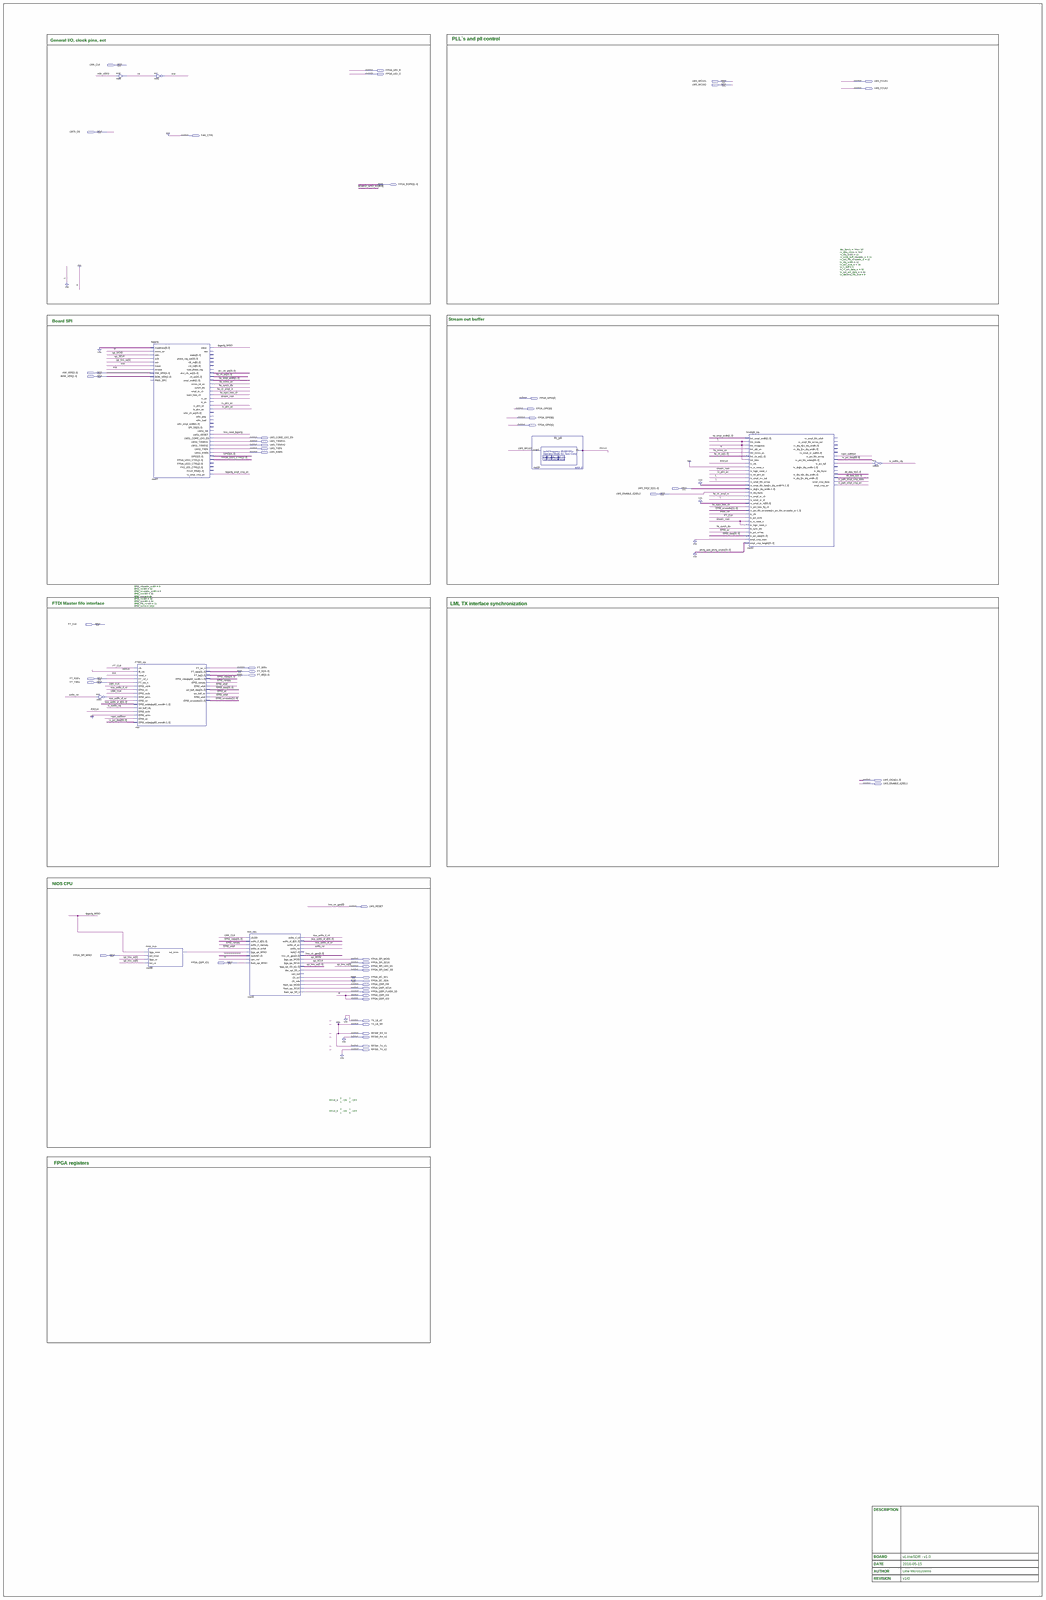
[diagram p0: schematic sheet, whole]
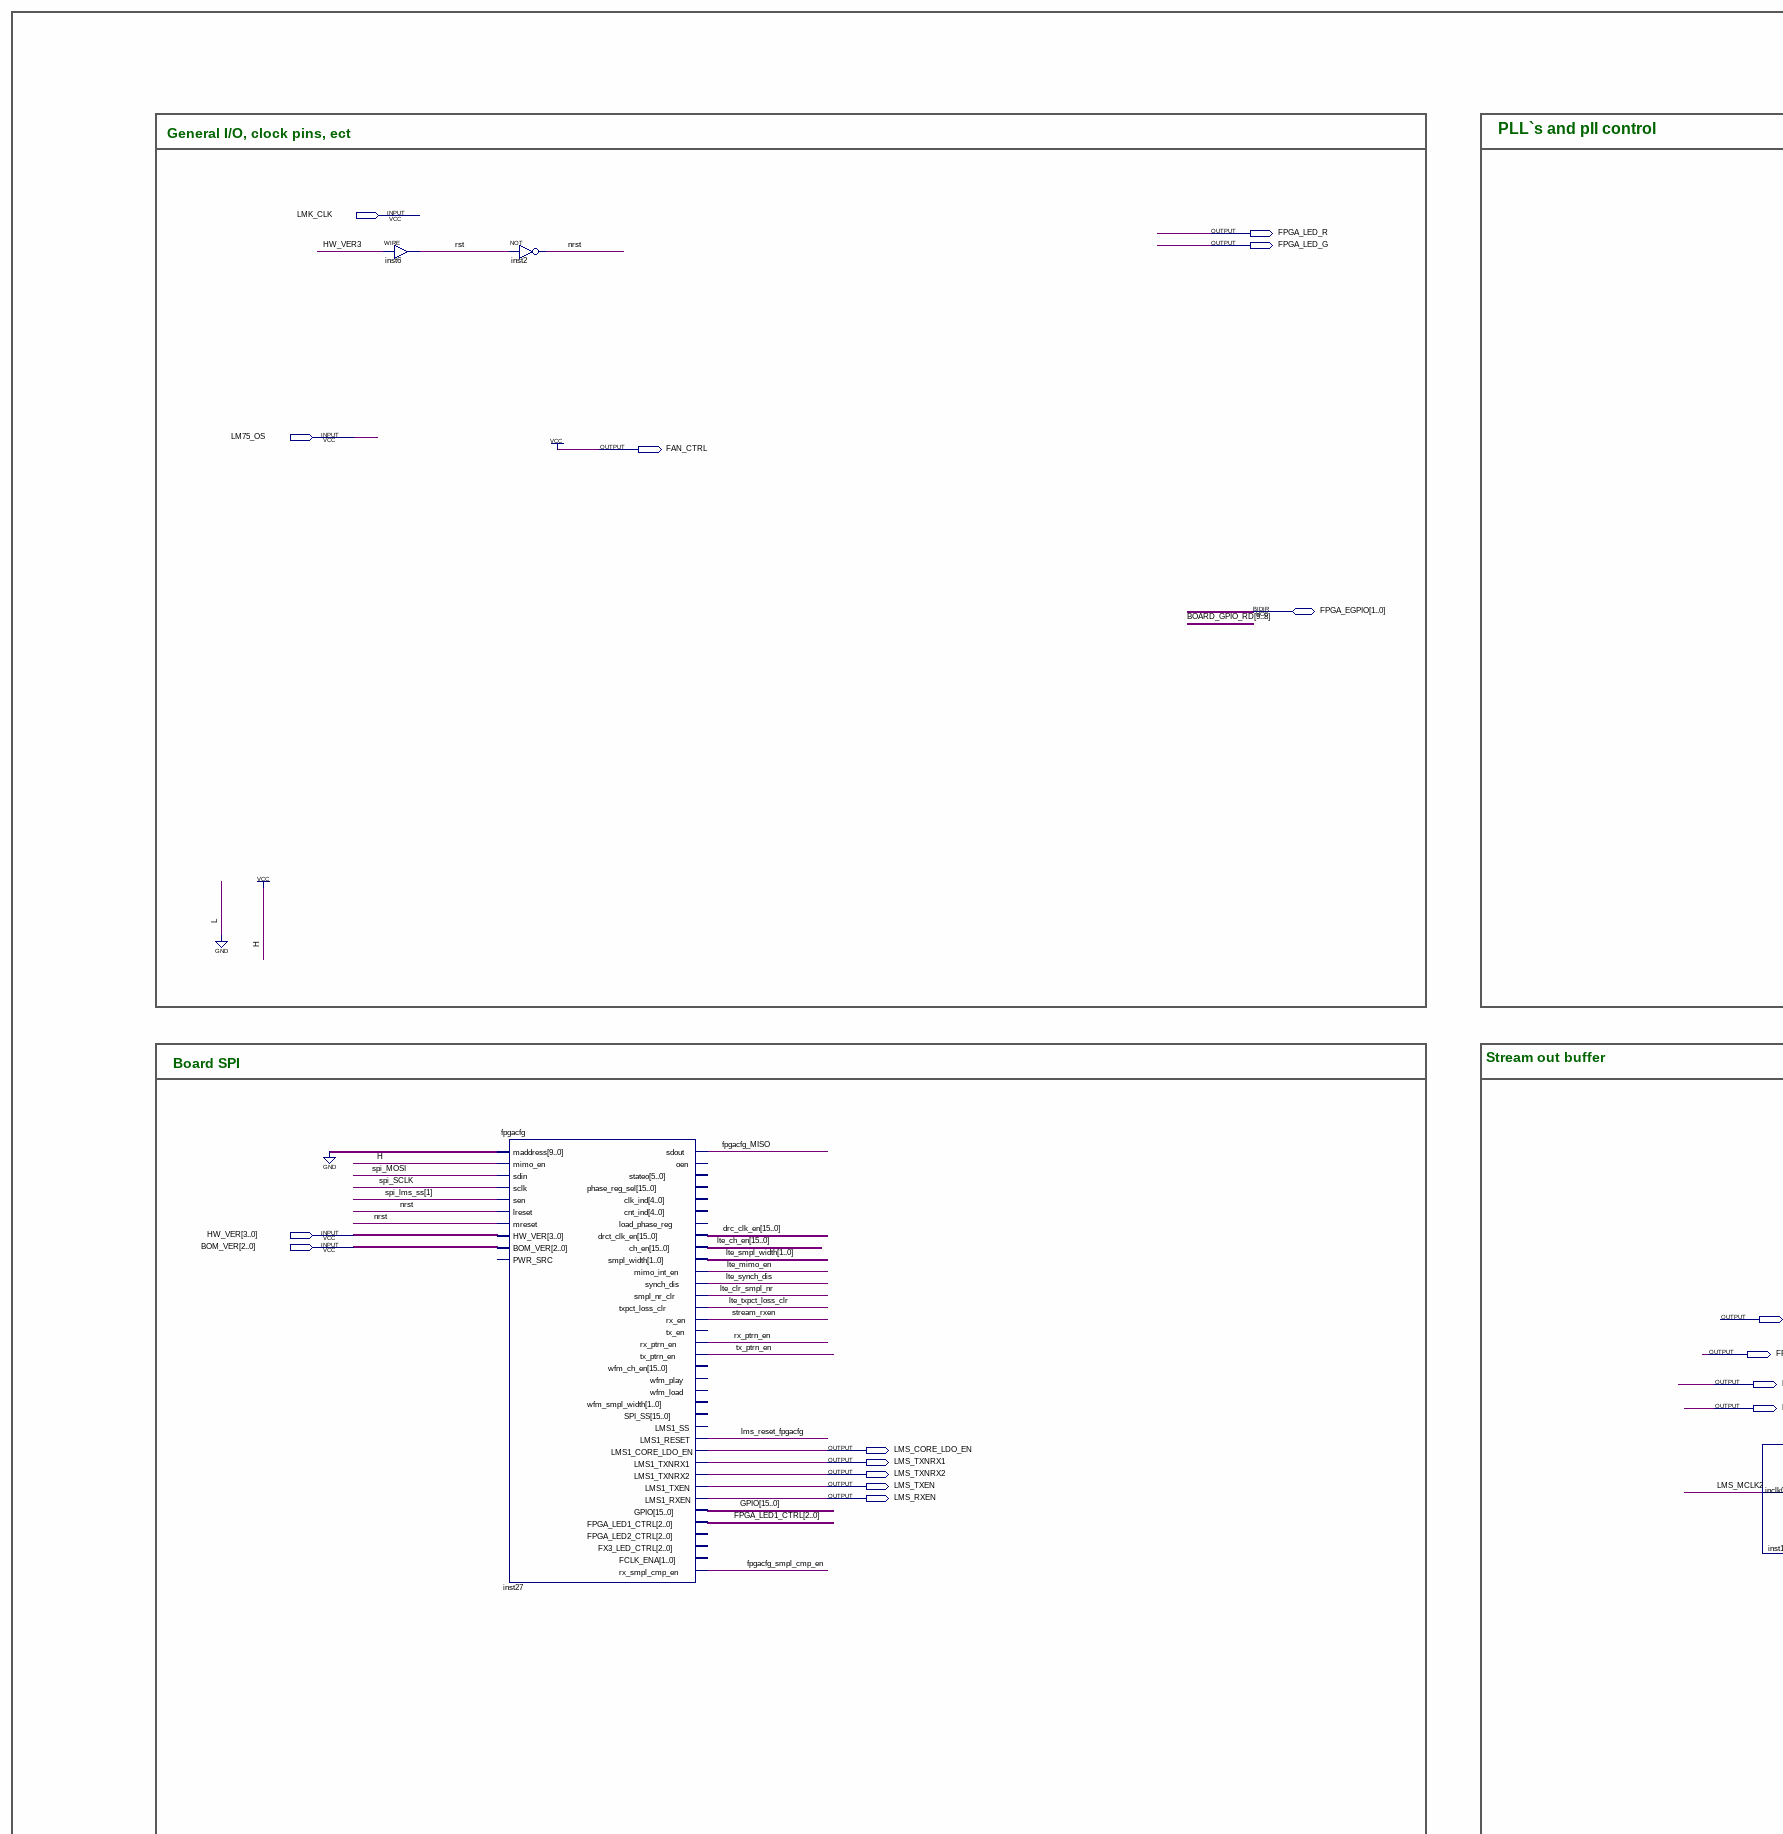
[diagram p1: schematic sheet, upper left part]
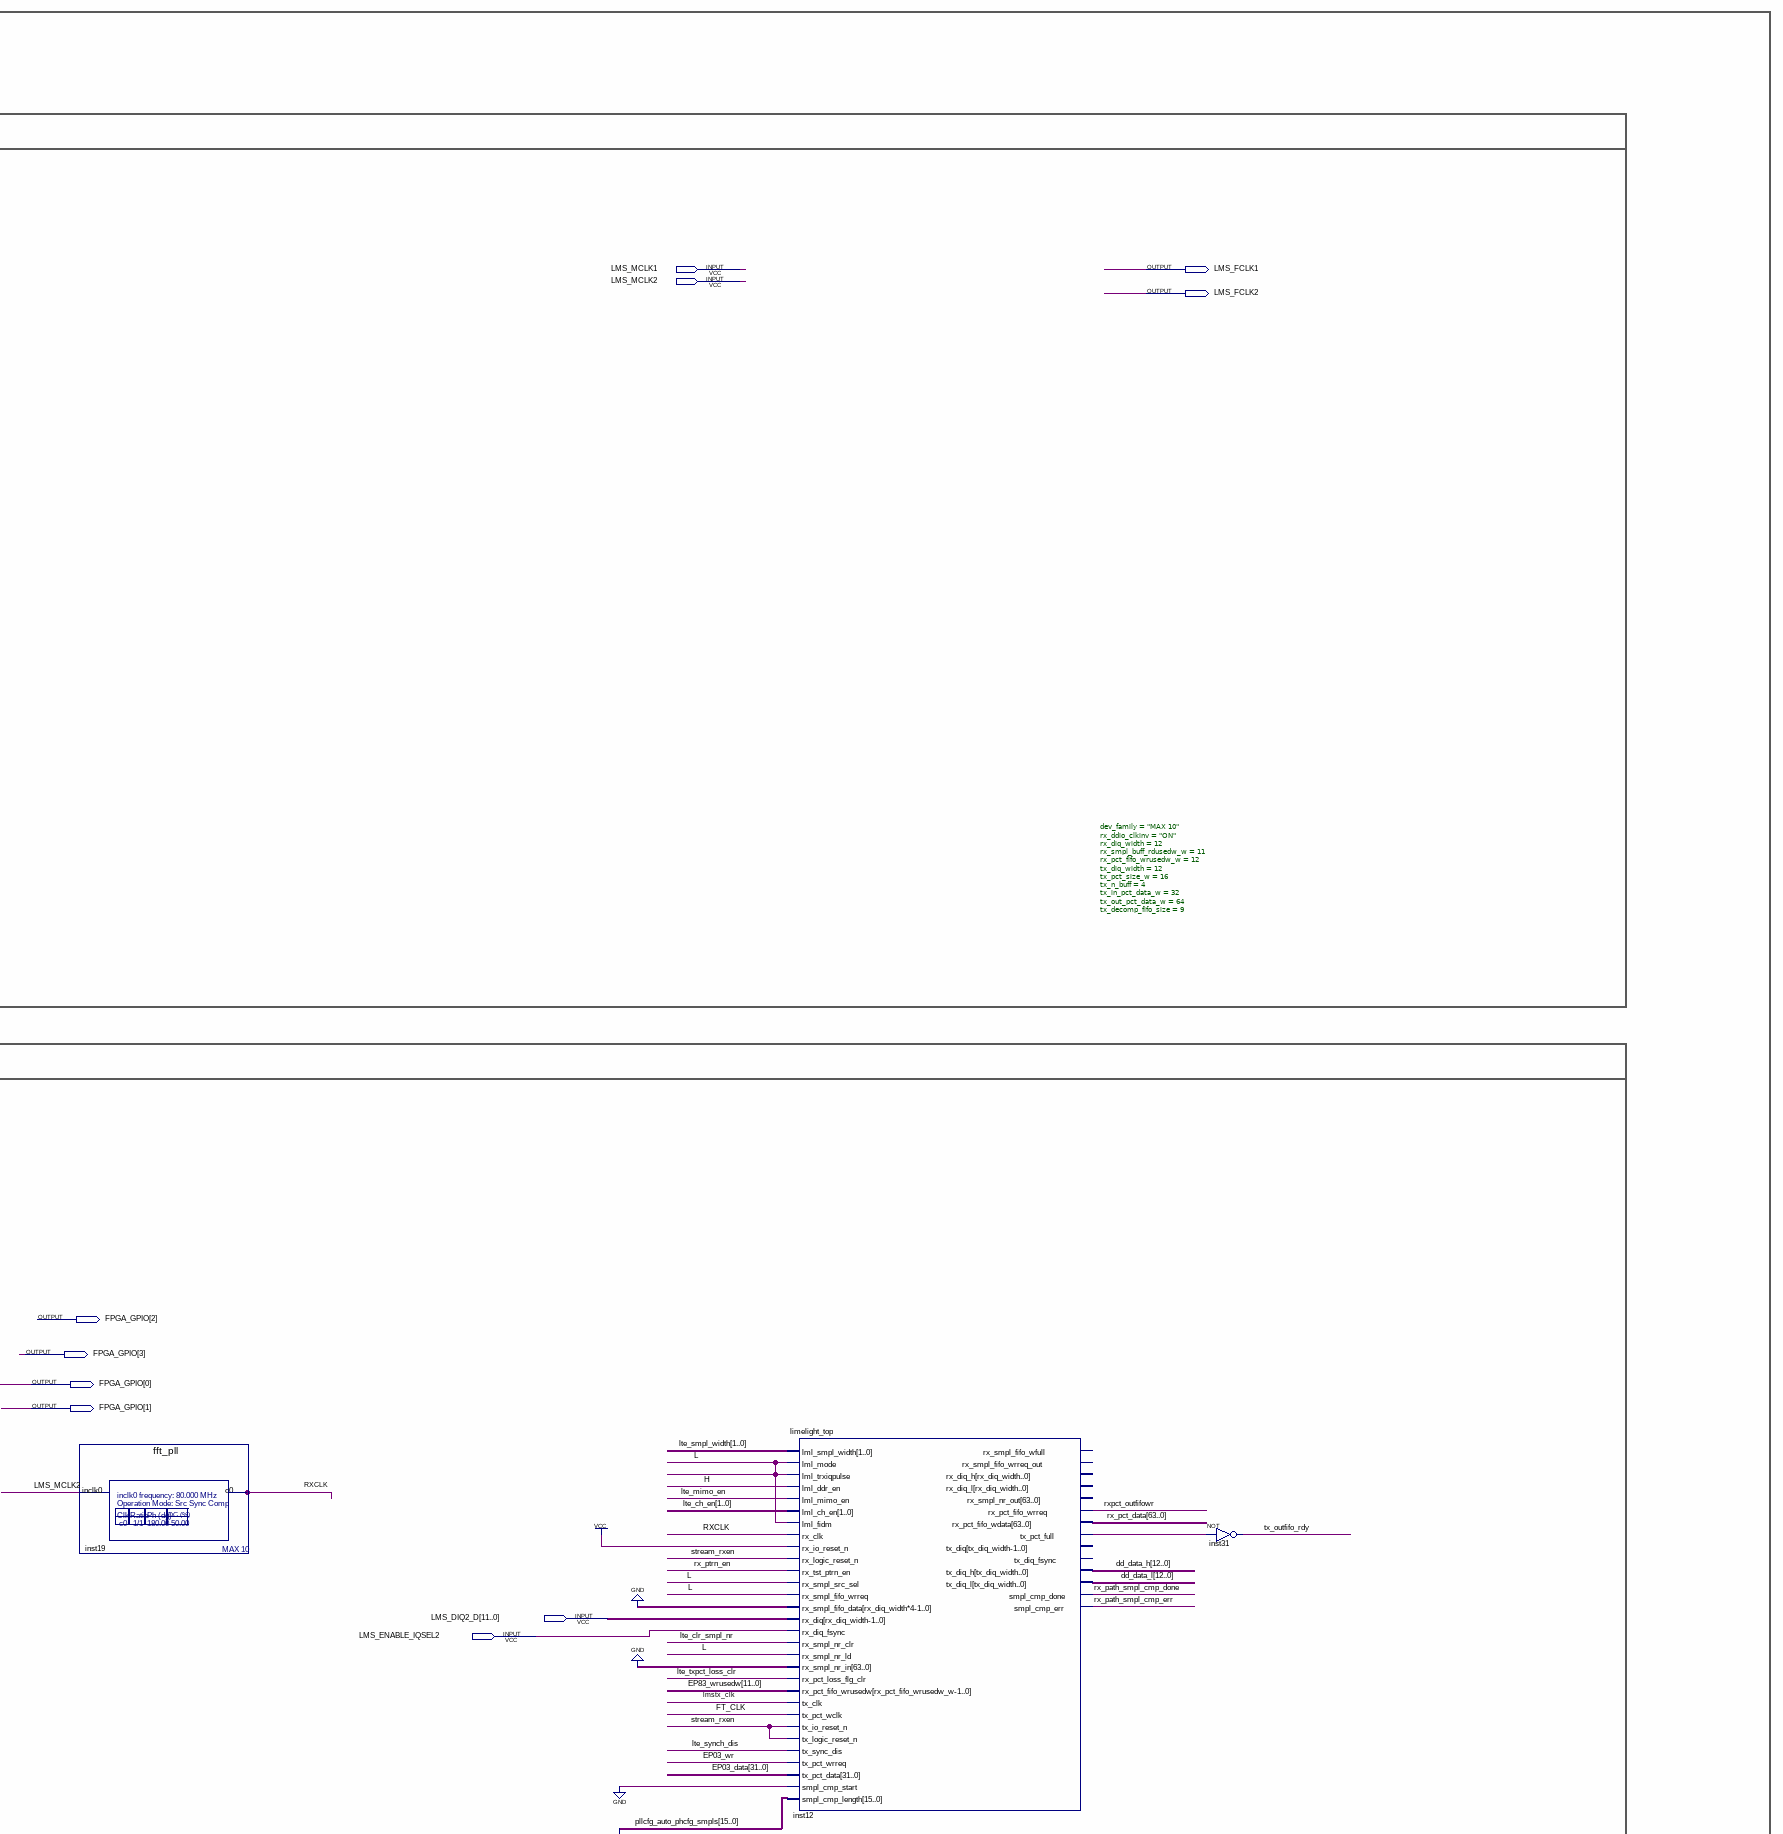
[diagram p2: schematic sheet, upper right part]
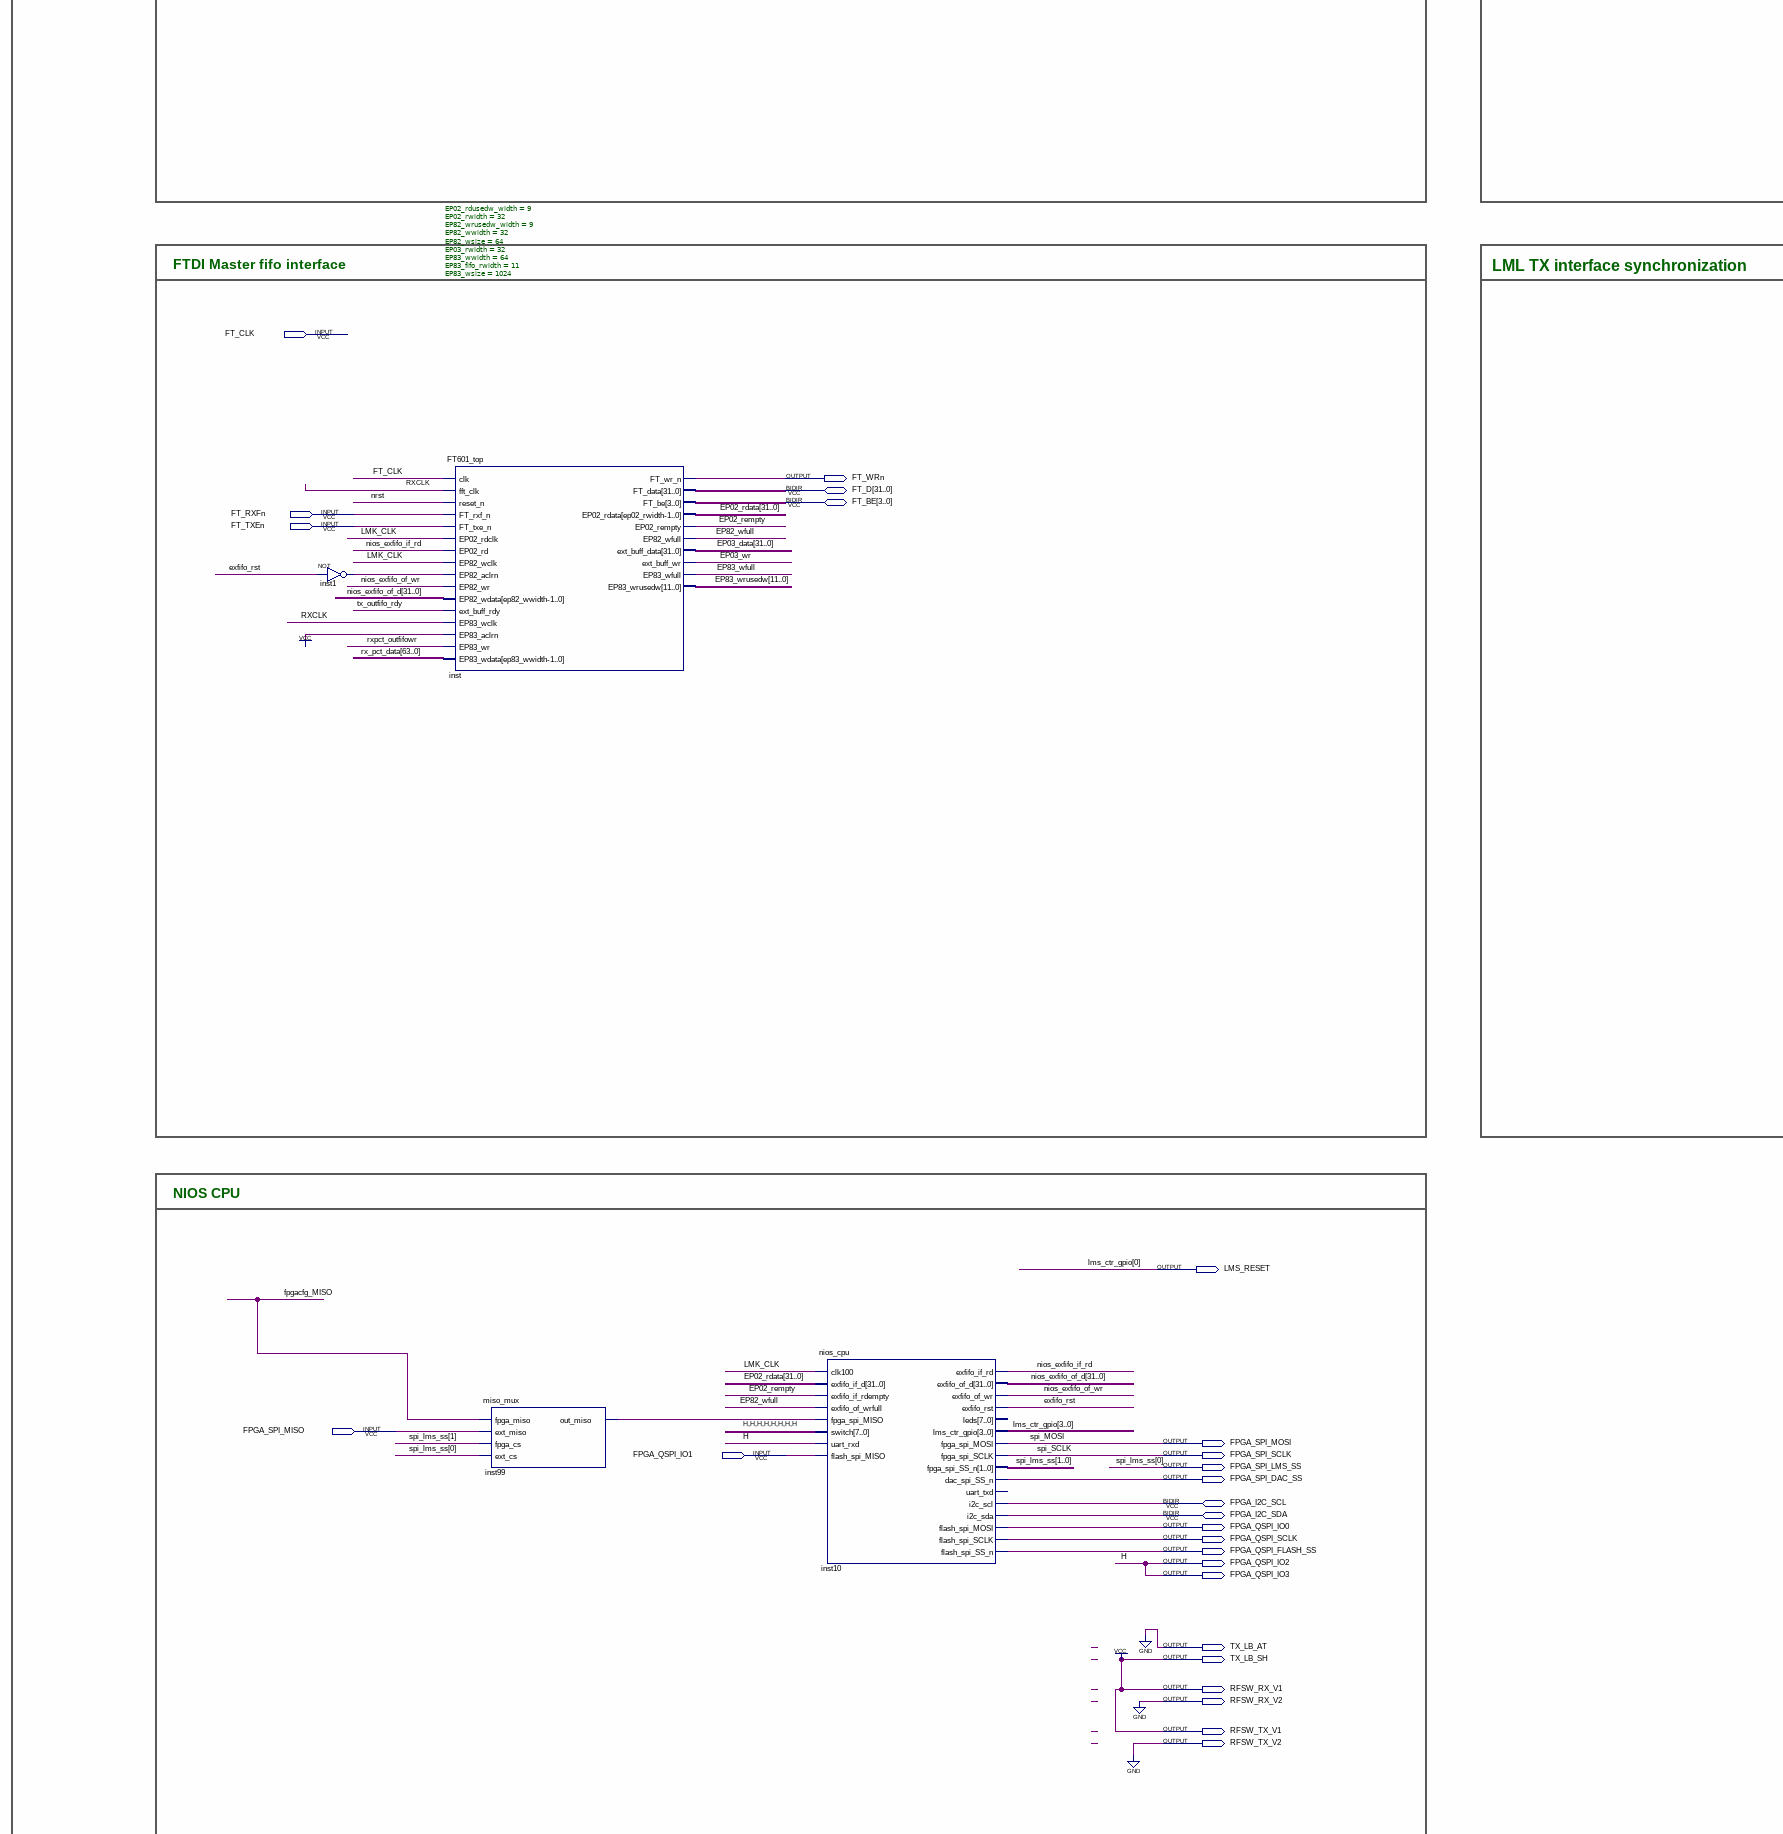
[diagram p3: schematic sheet, middle left part]
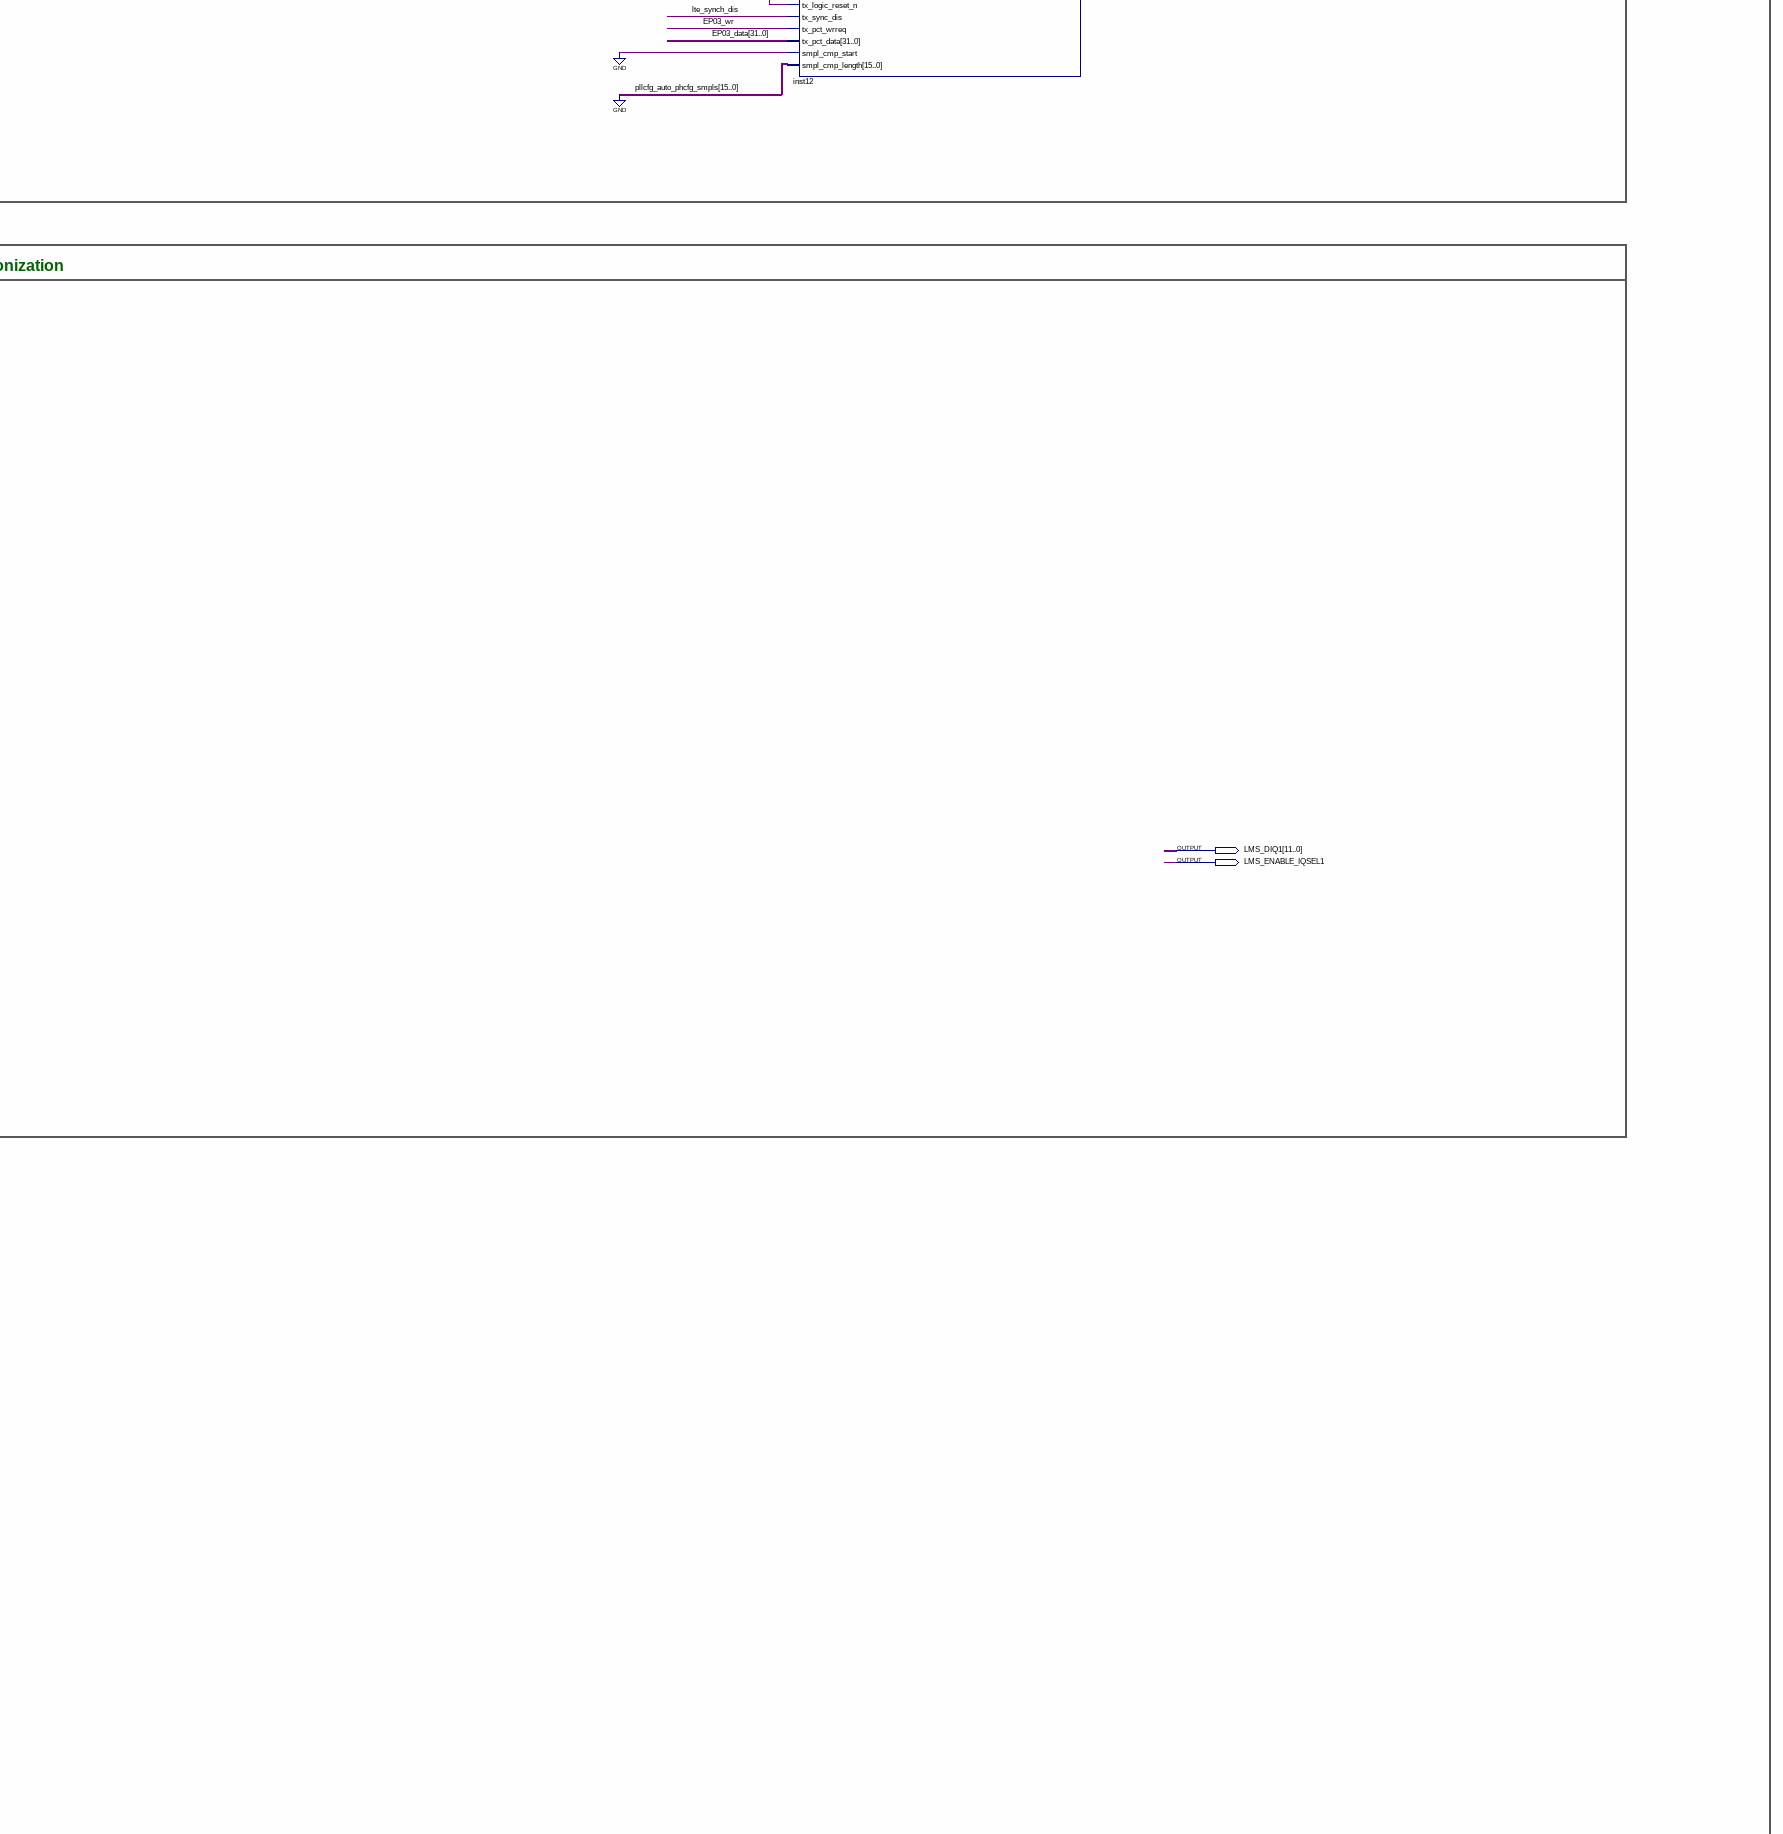
[diagram p4: schematic sheet, middle right part]
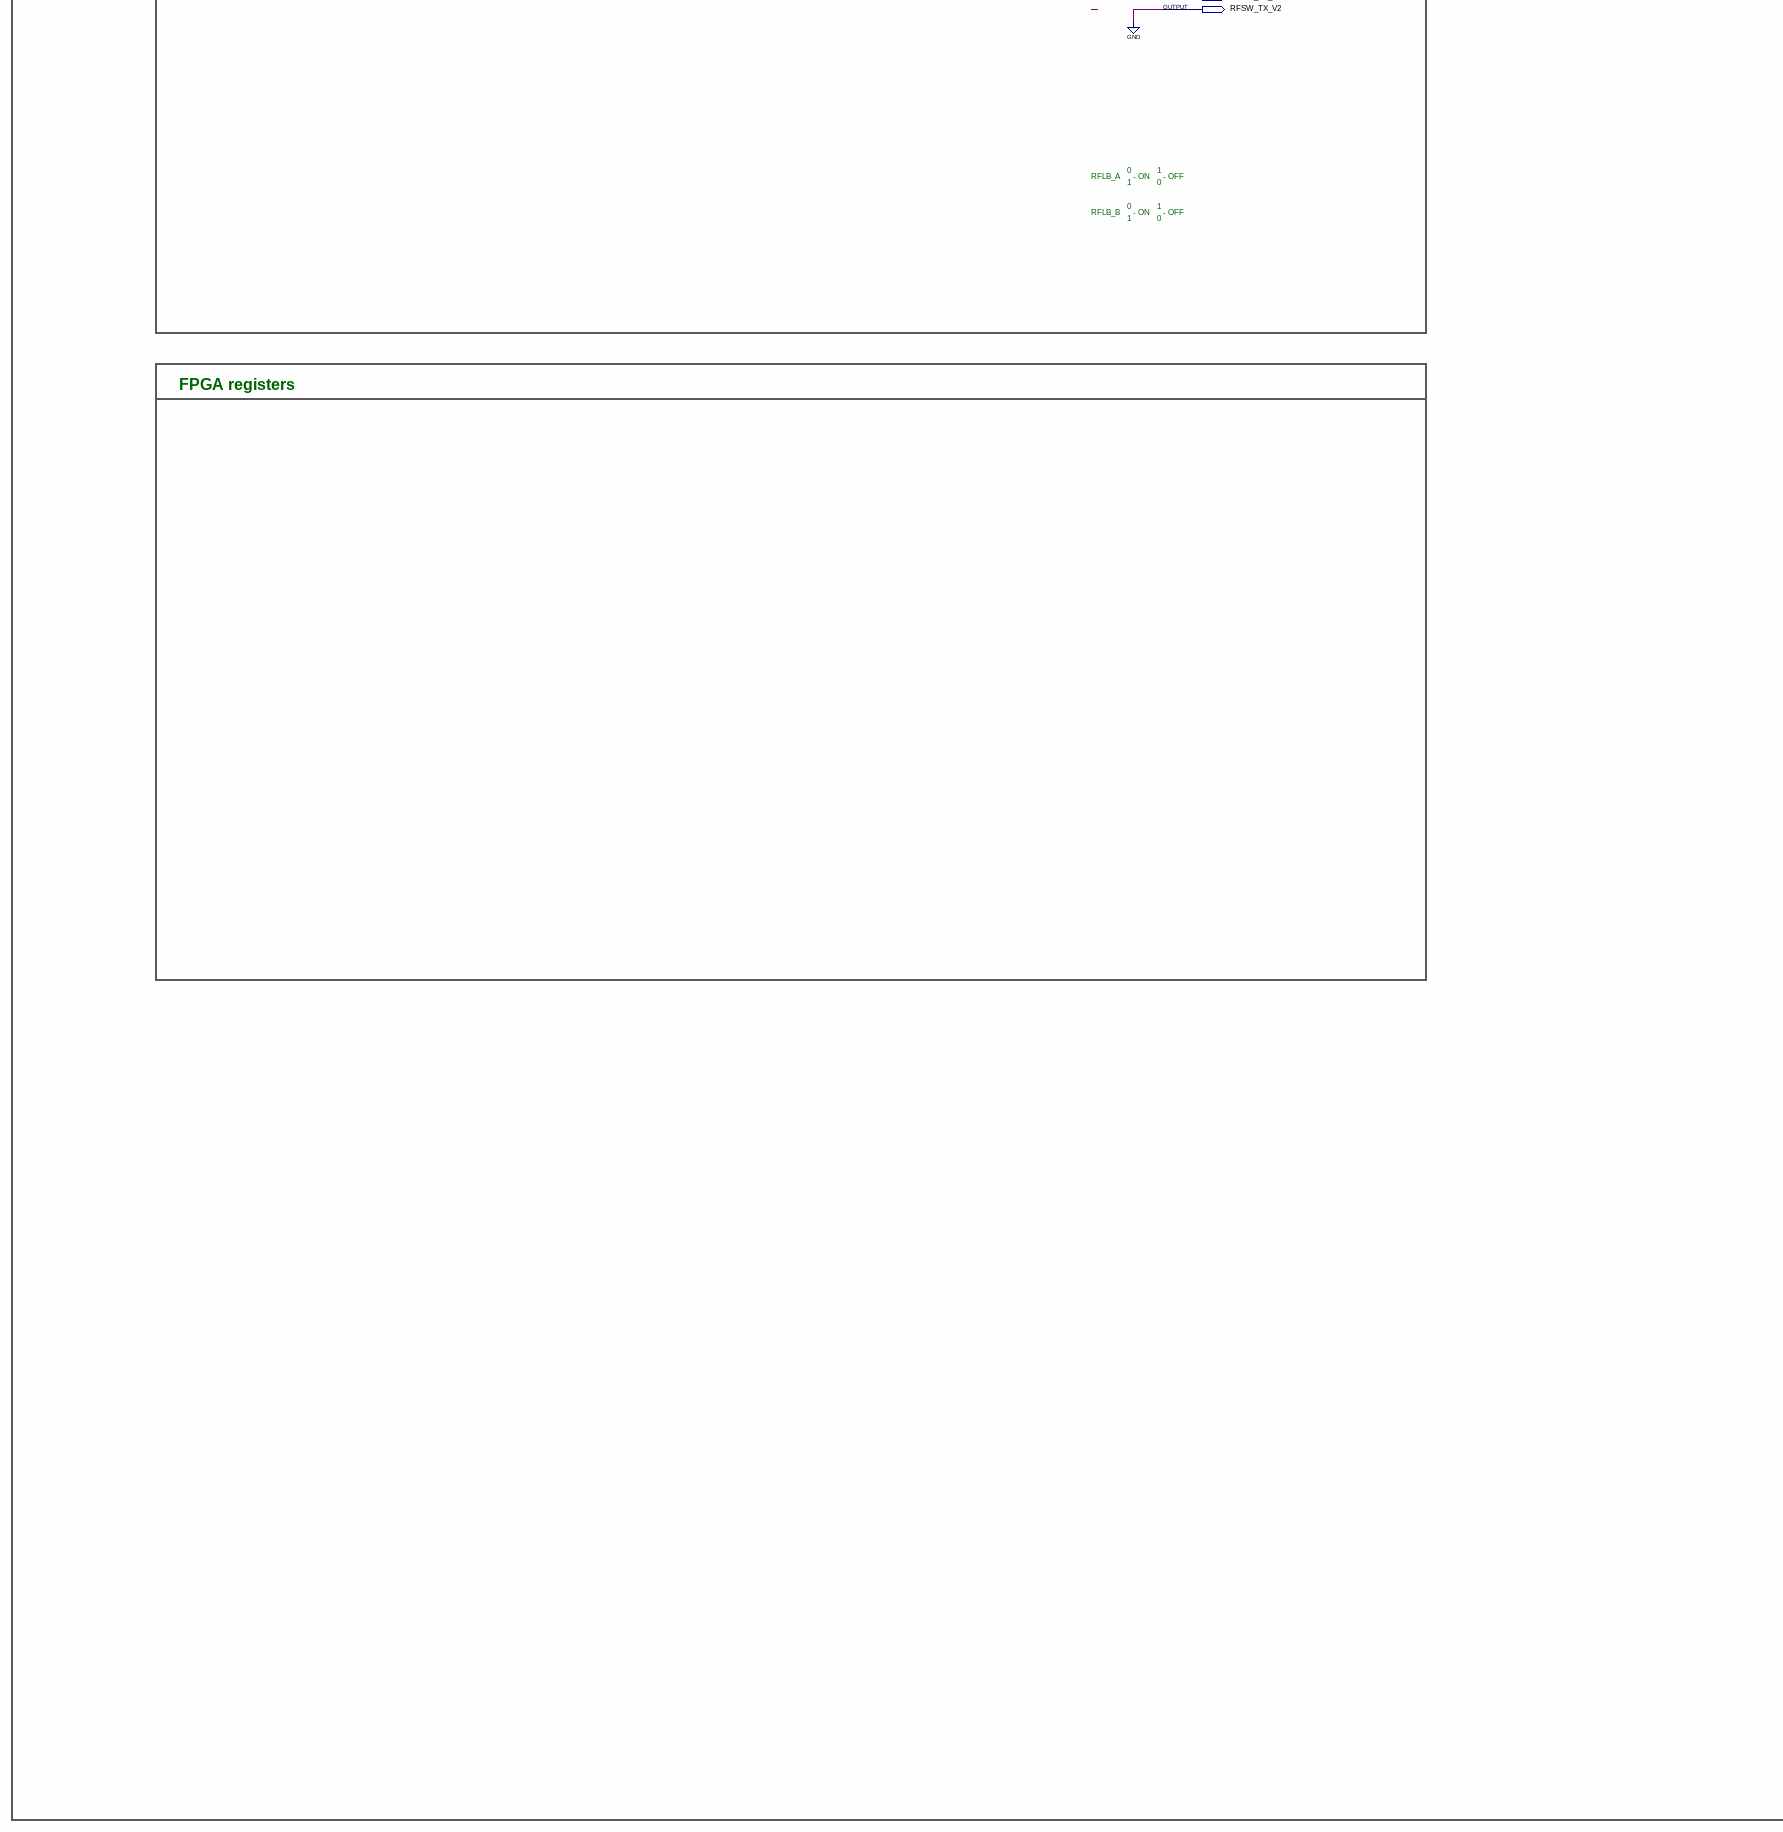
[diagram p5: schematic sheet, lower left part]
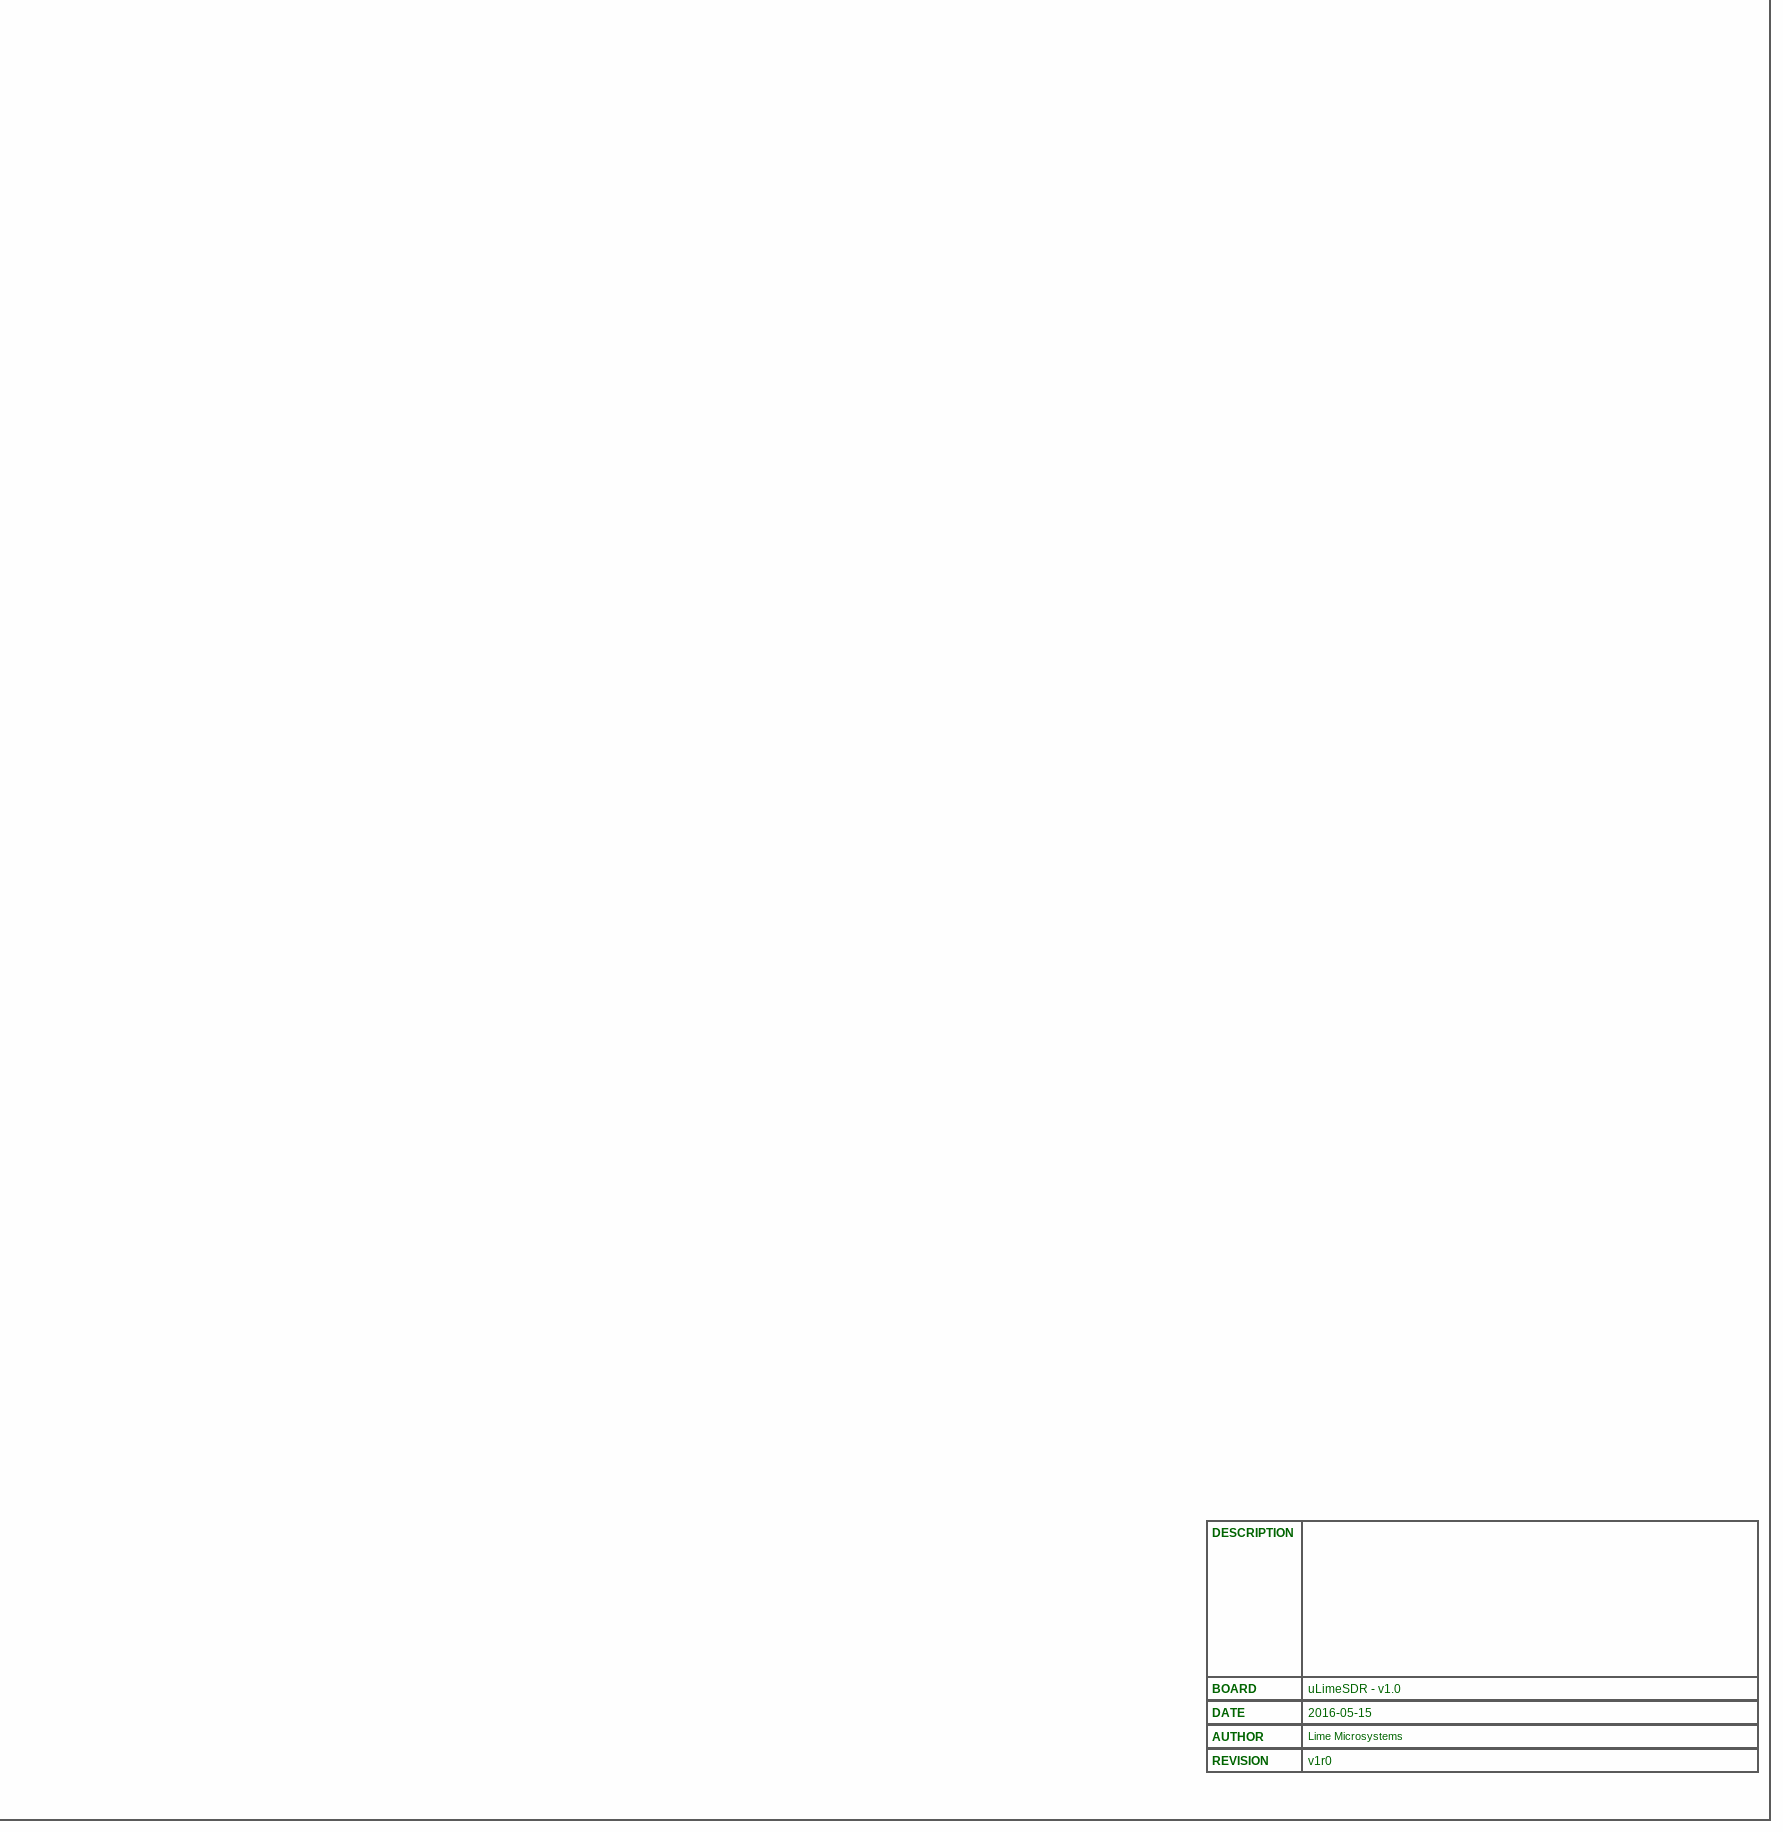
[diagram p6: schematic sheet, lower right part]
// Quartus schematic lms7_trx_top.bdf as structural Verilog: 10 symbols, 51 pins
module lms7_trx_top (
  input  LMK_CLK,
  input  LMS_MCLK1,
  input  LMS_MCLK2,
  input  LM75_OS,
  input  [3:0] HW_VER,
  input  [2:0] BOM_VER,
  input  [11:0] LMS_DIQ2_D,
  input  LMS_ENABLE_IQSEL2,
  input  FT_CLK,
  input  FT_RXFn,
  input  FT_TXEn,
  input  FPGA_SPI_MISO,
  input  FPGA_QSPI_IO1,
  inout  [1:0] FPGA_EGPIO,
  inout  [31:0] FT_D,
  inout  [3:0] FT_BE,
  inout  FPGA_I2C_SCL,
  inout  FPGA_I2C_SDA,
  output FPGA_LED_R,
  output FPGA_LED_G,
  output LMS_FCLK1,
  output LMS_FCLK2,
  output FAN_CTRL,
  output [3:0] FPGA_GPIO,
  output LMS_CORE_LDO_EN,
  output LMS_TXNRX1,
  output LMS_TXNRX2,
  output LMS_TXEN,
  output LMS_RXEN,
  output FT_WRn,
  output [11:0] LMS_DIQ1,
  output LMS_ENABLE_IQSEL1,
  output LMS_RESET,
  output FPGA_SPI_MOSI,
  output FPGA_SPI_SCLK,
  output FPGA_SPI_LMS_SS,
  output FPGA_SPI_DAC_SS,
  output FPGA_QSPI_IO0,
  output FPGA_QSPI_SCLK,
  output FPGA_QSPI_FLASH_SS,
  output FPGA_QSPI_IO2,
  output FPGA_QSPI_IO3,
  output TX_LB_AT,
  output TX_LB_SH,
  output RFSW_RX_V1,
  output RFSW_RX_V2,
  output RFSW_TX_V1,
  output RFSW_TX_V2
);

  wire EP02_rempty, EP03_wr, EP82_wfull, EP83_wfull, exfifo_rst, fpgacfg_MISO, fpgacfg_smpl_cmp_en,
       inst1_out, inst12_tx_pct_full, inst99_out_miso, lms_reset_fpgacfg, lmstx_clk, lte_clr_smpl_nr,
       lte_mimo_en, lte_synch_dis, lte_txpct_loss_clr, nios_exfifo_if_rd, nios_exfifo_of_wr, nrst, rst,
       rx_path_smpl_cmp_done, rx_path_smpl_cmp_err, rx_ptrn_en, RXCLK, rxpct_outfifowr, stream_rxen,
       tx_outfifo_rdy, tx_ptrn_en;
  wire [1:0] lte_smpl_width;
  wire [1:1] spi_lms_ss;
  wire [2:0] FPGA_LED1_CTRL;
  wire [3:1] lms_ctr_gpio;
  wire [11:0] EP83_wrusedw;
  wire [12:0] dd_data_h, dd_data_l;
  wire [15:0] drc_clk_en, GPIO, lte_ch_en;
  wire [31:0] EP02_rdata, EP03_data, nios_exfifo_of_d;
  wire [63:0] rx_pct_data;

  not inst1 (inst1_out, exfifo_rst);
  assign rst = HW_VER[3];  // WIRE inst6
  FT601_top #(.EP02_rdusedw_width(9), .EP02_rwidth(32), .EP82_wrusedw_width(9), .EP82_wwidth(32), .EP82_wsize(64), .EP03_rwidth(32), .EP83_wwidth(64), .EP83_fifo_rwidth(11), .EP83_wsize(1024)) inst (
    .clk(FT_CLK), .fft_clk(RXCLK), .reset_n(nrst), .FT_rxf_n(FT_RXFn), .FT_txe_n(FT_TXEn),
    .EP02_rdclk(LMK_CLK), .EP02_rd(nios_exfifo_if_rd), .EP82_wclk(LMK_CLK), .EP82_aclrn(inst1_out),
    .EP82_wr(nios_exfifo_of_wr), .EP82_wdata(nios_exfifo_of_d), .ext_buff_rdy(tx_outfifo_rdy),
    .EP83_wclk(RXCLK), .EP83_aclrn(1'b1), .EP83_wr(rxpct_outfifowr), .EP83_wdata(rx_pct_data),
    .FT_wr_n(FT_WRn), .EP02_rdata(EP02_rdata), .EP02_rempty(EP02_rempty), .EP82_wfull(EP82_wfull),
    .ext_buff_data(EP03_data), .ext_buff_wr(EP03_wr), .EP83_wfull(EP83_wfull), .EP83_wrusedw(EP83_wrusedw),
    .FT_data(FT_D), .FT_be(FT_BE));
  not inst2 (nrst, rst);
  fpgacfg inst27 (
    .maddress({10{1'b0}}), .mimo_en(1'b1), .sdin(FPGA_SPI_MOSI), .sclk(FPGA_SPI_SCLK), .sen(spi_lms_ss[1]),
    .lreset(nrst), .mreset(nrst), .HW_VER(HW_VER), .BOM_VER(BOM_VER), .sdout(fpgacfg_MISO),
    .drct_clk_en(drc_clk_en), .ch_en(lte_ch_en), .smpl_width(lte_smpl_width), .mimo_int_en(lte_mimo_en),
    .synch_dis(lte_synch_dis), .smpl_nr_clr(lte_clr_smpl_nr), .txpct_loss_clr(lte_txpct_loss_clr),
    .rx_en(stream_rxen), .rx_ptrn_en(rx_ptrn_en), .tx_ptrn_en(tx_ptrn_en), .LMS1_RESET(lms_reset_fpgacfg),
    .LMS1_CORE_LDO_EN(LMS_CORE_LDO_EN), .LMS1_TXNRX1(LMS_TXNRX1), .LMS1_TXNRX2(LMS_TXNRX2),
    .LMS1_TXEN(LMS_TXEN), .LMS1_RXEN(LMS_RXEN), .GPIO(GPIO), .FPGA_LED1_CTRL(FPGA_LED1_CTRL),
    .rx_smpl_cmp_en(fpgacfg_smpl_cmp_en));  // open: PWR_SRC, oen, stateo, phase_reg_sel, clk_ind, cnt_ind, load_phase_reg, tx_en, wfm_ch_en, wfm_play, wfm_load, wfm_smpl_width, SPI_SS, LMS1_SS, FPGA_LED2_CTRL, FX3_LED_CTRL, FCLK_ENA
  miso_mux inst99 (
    .fpga_miso(fpgacfg_MISO), .ext_miso(FPGA_SPI_MISO), .fpga_cs(spi_lms_ss[1]), .ext_cs(FPGA_SPI_LMS_SS),
    .out_miso(inst99_out_miso));
  nios_cpu inst10 (
    .clk100(LMK_CLK), .exfifo_if_d(EP02_rdata), .exfifo_if_rdempty(EP02_rempty),
    .exfifo_of_wrfull(EP82_wfull), .fpga_spi_MISO(inst99_out_miso), .switch({8{1'b1}}), .uart_rxd(1'b1),
    .flash_spi_MISO(FPGA_QSPI_IO1), .exfifo_if_rd(nios_exfifo_if_rd), .exfifo_of_d(nios_exfifo_of_d),
    .exfifo_of_wr(nios_exfifo_of_wr), .exfifo_rst(exfifo_rst), .lms_ctr_gpio({lms_ctr_gpio, LMS_RESET}),
    .fpga_spi_MOSI(FPGA_SPI_MOSI), .fpga_spi_SCLK(FPGA_SPI_SCLK),
    .fpga_spi_SS_n({spi_lms_ss[1], FPGA_SPI_LMS_SS}), .dac_spi_SS_n(FPGA_SPI_DAC_SS),
    .flash_spi_MOSI(FPGA_QSPI_IO0), .flash_spi_SCLK(FPGA_QSPI_SCLK), .flash_spi_SS_n(FPGA_QSPI_FLASH_SS),
    .i2c_scl(FPGA_I2C_SCL), .i2c_sda(FPGA_I2C_SDA));  // open: leds, uart_txd
  fft_pll inst19 (.inclk0(LMS_MCLK2), .c0(RXCLK));
  limelight_top #(.dev_family("MAX 10"), .rx_ddio_clkinv("ON"), .rx_diq_width(12), .rx_smpl_buff_rdusedw_w(11), .rx_pct_fifo_wrusedw_w(12), .tx_diq_width(12), .tx_pct_size_w(16), .tx_n_buff(4), .tx_in_pct_data_w(32), .tx_out_pct_data_w(64), .tx_decomp_fifo_size(9)) inst12 (
    .lml_smpl_width(lte_smpl_width), .lml_mode(1'b0), .lml_trxiqpulse(1'b0), .lml_ddr_en(1'b1),
    .lml_mimo_en(lte_mimo_en), .lml_ch_en(lte_ch_en[1:0]), .lml_fidm(1'b0), .rx_clk(RXCLK),
    .rx_io_reset_n(1'b1), .rx_logic_reset_n(stream_rxen), .rx_tst_ptrn_en(rx_ptrn_en),
    .rx_smpl_src_sel(1'b0), .rx_smpl_fifo_wrreq(1'b0), .rx_smpl_fifo_data({48{1'b0}}), .rx_diq(LMS_DIQ2_D),
    .rx_diq_fsync(LMS_ENABLE_IQSEL2), .rx_smpl_nr_clr(lte_clr_smpl_nr), .rx_smpl_nr_ld(1'b0),
    .rx_smpl_nr_in({64{1'b0}}), .rx_pct_loss_flg_clr(lte_txpct_loss_clr), .rx_pct_fifo_wrusedw(EP83_wrusedw),
    .tx_clk(lmstx_clk), .tx_pct_wclk(FT_CLK), .tx_io_reset_n(stream_rxen), .tx_logic_reset_n(stream_rxen),
    .tx_sync_dis(lte_synch_dis), .tx_pct_wrreq(EP03_wr), .tx_pct_data(EP03_data), .smpl_cmp_start(1'b0),
    .smpl_cmp_length({16{1'b0}}), .rx_pct_fifo_wrreq(rxpct_outfifowr), .rx_pct_fifo_wdata(rx_pct_data),
    .tx_pct_full(inst12_tx_pct_full), .tx_diq_h(dd_data_h), .tx_diq_l(dd_data_l),
    .smpl_cmp_done(rx_path_smpl_cmp_done), .smpl_cmp_err(rx_path_smpl_cmp_err));  // open: rx_smpl_fifo_wfull, rx_smpl_fifo_wrreq_out, rx_diq_h, rx_diq_l, rx_smpl_nr_out, tx_diq, tx_diq_fsync
  not inst31 (tx_outfifo_rdy, inst12_tx_pct_full);

  assign FAN_CTRL = 1'b1;
  assign FPGA_QSPI_IO2 = 1'b1;
  assign FPGA_QSPI_IO3 = 1'b1;
  assign RFSW_RX_V1 = 1'b1;
  assign RFSW_RX_V2 = 1'b0;
  assign RFSW_TX_V1 = 1'b1;
  assign RFSW_TX_V2 = 1'b0;
  assign TX_LB_AT = 1'b0;
  assign TX_LB_SH = 1'b1;

  // Other names for the same wires on the sheet: lms_ctr_gpio[0] = LMS_RESET; spi_lms_ss[0] = FPGA_SPI_LMS_SS;
  //   spi_MOSI = FPGA_SPI_MOSI; spi_SCLK = FPGA_SPI_SCLK

  // Notes on the sheet:
  //   PLL`s and pll control
  //   General I/O, clock pins, ect
  //   Stream out buffer
  //   Board SPI
  //   FTDI Master fifo interface
  //   LML TX interface synchronization
  //   NIOS CPU
  //   0
  //   1
  //   RFLB_A
  //   - ON
  //   - OFF
  //   1
  //   0
  //   0
  //   1
  //   RFLB_B
  //   - ON
  //   - OFF
  //   1
  //   0
  //   FPGA registers
  //   DESCRIPTION
  //   BOARD
  //   uLimeSDR - v1.0
  //   DATE
  //   2016-05-15
  //   AUTHOR
  //   Lime Microsystems
  //   REVISION
  //   v1r0
endmodule
